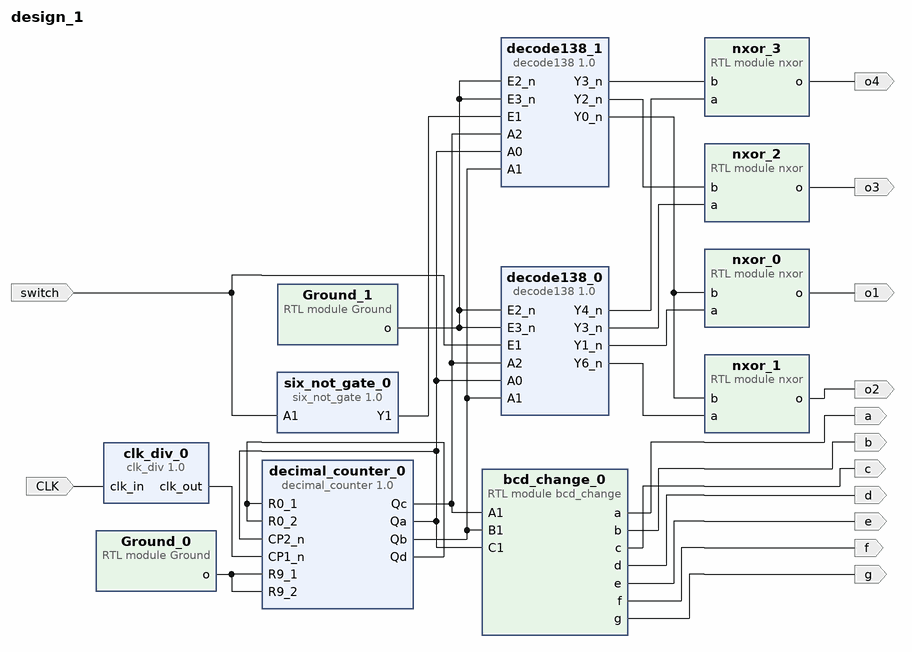
[diagram p0: block diagram of the top level]
# Vivado block design design_1, xc7a35tcpg236-1, Vivado 2017.2
create_bd_design design_1

create_bd_port -dir O o1
create_bd_port -dir O o2
create_bd_port -dir O o3
create_bd_port -dir O o4
create_bd_port -dir I CLK
create_bd_port -dir I switch
create_bd_port -dir O a
create_bd_port -dir O b
create_bd_port -dir O c
create_bd_port -dir O d
create_bd_port -dir O e
create_bd_port -dir O f
create_bd_port -dir O g

create_bd_cell -type ip -vlnv xilinx.com:xup:decimal_counter:1.0 decimal_counter_0
create_bd_cell -type ip -vlnv xilinx.com:XUP:decode138:1.0 decode138_0
create_bd_cell -type ip -vlnv xilinx.com:xup:clk_div:1.0 clk_div_0
set_property -dict {CONFIG.N 99999} [get_bd_cells clk_div_0]
create_bd_cell -type ip -vlnv xilinx.com:XUP:decode138:1.0 decode138_1
create_bd_cell -type ip -vlnv xilinx.com:XUP:six_not_gate:1.0 six_not_gate_0
create_bd_cell -type module -reference Ground Ground_0
create_bd_cell -type module -reference Ground Ground_1
create_bd_cell -type module -reference bcd_change bcd_change_0
create_bd_cell -type module -reference nxor nxor_0
create_bd_cell -type module -reference nxor nxor_1
create_bd_cell -type module -reference nxor nxor_2
create_bd_cell -type module -reference nxor nxor_3

# ---- connections ----

connect_bd_net -net clk_in_1 [get_bd_ports CLK] [get_bd_pins clk_div_0/clk_in]
connect_bd_net [get_bd_pins clk_div_0/clk_out] [get_bd_pins decimal_counter_0/CP1_n]
connect_bd_net [get_bd_pins Ground_0/o] [get_bd_pins decimal_counter_0/R9_1] [get_bd_pins decimal_counter_0/R9_2]
connect_bd_net [get_bd_pins decimal_counter_0/Qd] [get_bd_pins decimal_counter_0/R0_1] [get_bd_pins decimal_counter_0/R0_2]
connect_bd_net [get_bd_pins Ground_1/o] \
  [get_bd_pins decode138_0/E2_n] [get_bd_pins decode138_0/E3_n] [get_bd_pins decode138_1/E2_n] [get_bd_pins decode138_1/E3_n]
connect_bd_net [get_bd_ports switch] [get_bd_pins decode138_0/E1] [get_bd_pins six_not_gate_0/A1]
connect_bd_net [get_bd_pins six_not_gate_0/Y1] [get_bd_pins decode138_1/E1]
connect_bd_net [get_bd_pins bcd_change_0/a] [get_bd_ports a]
connect_bd_net [get_bd_pins bcd_change_0/b] [get_bd_ports b]
connect_bd_net [get_bd_pins bcd_change_0/c] [get_bd_ports c]
connect_bd_net [get_bd_pins bcd_change_0/d] [get_bd_ports d]
connect_bd_net [get_bd_pins bcd_change_0/e] [get_bd_ports e]
connect_bd_net [get_bd_pins bcd_change_0/f] [get_bd_ports f]
connect_bd_net [get_bd_pins bcd_change_0/g] [get_bd_ports g]
connect_bd_net [get_bd_pins decode138_0/Y1_n] [get_bd_pins nxor_0/a]
connect_bd_net [get_bd_pins decode138_0/Y6_n] [get_bd_pins nxor_1/a]
connect_bd_net [get_bd_pins decode138_0/Y3_n] [get_bd_pins nxor_2/a]
connect_bd_net [get_bd_pins decode138_0/Y4_n] [get_bd_pins nxor_3/a]
connect_bd_net [get_bd_pins decode138_1/Y0_n] [get_bd_pins nxor_0/b] [get_bd_pins nxor_1/b]
connect_bd_net [get_bd_pins decode138_1/Y2_n] [get_bd_pins nxor_2/b]
connect_bd_net [get_bd_pins decode138_1/Y3_n] [get_bd_pins nxor_3/b]
connect_bd_net [get_bd_pins nxor_0/o] [get_bd_ports o1]
connect_bd_net [get_bd_pins nxor_1/o] [get_bd_ports o2]
connect_bd_net [get_bd_pins nxor_2/o] [get_bd_ports o3]
connect_bd_net [get_bd_pins nxor_3/o] [get_bd_ports o4]
connect_bd_net [get_bd_pins decimal_counter_0/Qc] [get_bd_pins bcd_change_0/A1] [get_bd_pins decode138_0/A2] [get_bd_pins decode138_1/A2]
connect_bd_net [get_bd_pins decimal_counter_0/Qb] [get_bd_pins bcd_change_0/B1] [get_bd_pins decode138_0/A1] [get_bd_pins decode138_1/A1]
connect_bd_net [get_bd_pins decimal_counter_0/Qa] \
  [get_bd_pins bcd_change_0/C1] [get_bd_pins decimal_counter_0/CP2_n] [get_bd_pins decode138_0/A0] \
  [get_bd_pins decode138_1/A0]

validate_bd_design
save_bd_design
